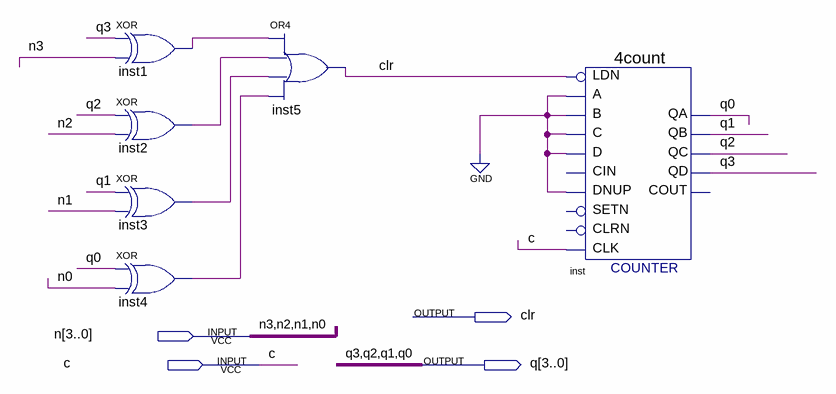
[diagram p0: schematic sheet]
// Quartus schematic s73_cdiv1.bdf as structural Verilog: 6 symbols, 4 pins
module s73_cdiv1 (
  input  [3:0] n,
  input  c,
  output clr,
  output [3:0] q
);

  wire inst1_out, inst2_out, inst3_out, inst4_out;

  xor inst1 (inst1_out, q[3], n[3]);
  xor inst2 (inst2_out, q[2], n[2]);
  xor inst3 (inst3_out, q[1], n[1]);
  xor inst4 (inst4_out, q[0], n[0]);
  or inst5 (clr, inst1_out, inst2_out, inst3_out, inst4_out);
  \4count  inst (
    .LDN(clr), .B(1'b0), .A(1'b0), .D(1'b0), .DNUP(1'b0), .CLK(c), .C(1'b0), .QA(q[0]), .QB(q[1]), .QC(q[2]),
    .QD(q[3]));  // open: CIN, SETN, CLRN, COUT
endmodule
